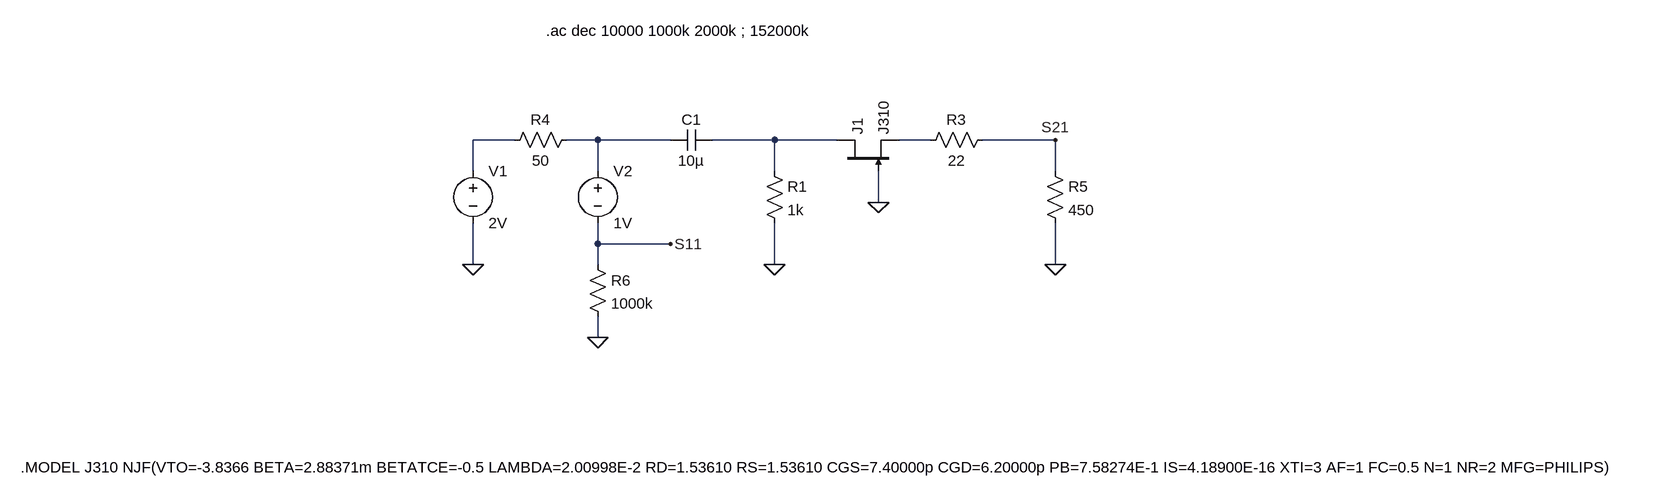
[diagram p0: schematic Draft3.asc]
Draft3.asc, the LTspice schematic file:
Version 4
SHEET 1 1640 696
WIRE -224 176 -288 176
WIRE -96 176 -144 176
WIRE 16 176 -96 176
WIRE 176 176 80 176
WIRE 272 176 176 176
WIRE 416 176 368 176
WIRE 608 176 496 176
WIRE -288 224 -288 176
WIRE -96 224 -96 176
WIRE 176 224 176 176
WIRE 608 224 608 176
WIRE 336 272 336 224
WIRE -96 336 -96 304
WIRE 16 336 -96 336
WIRE -288 368 -288 304
WIRE -96 368 -96 336
WIRE 176 368 176 304
WIRE 608 368 608 304
WIRE -96 480 -96 448
FLAG -288 368 0
FLAG -96 480 0
FLAG 176 368 0
FLAG 336 272 0
FLAG 608 368 0
FLAG 16 336 S11
FLAG 608 176 S21
SYMBOL cap 80 160 R90
WINDOW 0 0 32 VBottom 2
WINDOW 3 32 32 VTop 2
SYMATTR InstName C1
SYMATTR Value 10µ
SYMBOL res 160 208 R0
SYMATTR InstName R1
SYMATTR Value 1k
SYMBOL res 512 160 R90
WINDOW 0 0 56 VBottom 2
WINDOW 3 32 56 VTop 2
SYMATTR InstName R3
SYMATTR Value 22
SYMBOL njf 272 224 R270
SYMATTR InstName J1
SYMATTR Value J310
SYMBOL voltage -288 208 R0
WINDOW 123 0 0 Left 0
WINDOW 39 0 0 Left 0
SYMATTR InstName V1
SYMATTR Value 2V
SYMBOL voltage -96 208 R0
SYMATTR InstName V2
SYMATTR Value 1V
SYMBOL res -128 160 R90
WINDOW 0 0 56 VBottom 2
WINDOW 3 32 56 VTop 2
SYMATTR InstName R4
SYMATTR Value 50
SYMBOL res 592 208 R0
SYMATTR InstName R5
SYMATTR Value 450
SYMBOL res -112 352 R0
SYMATTR InstName R6
SYMATTR Value 1000k
TEXT -984 680 Left 2 !.MODEL J310 NJF(VTO=-3.8366 BETA=2.88371m BETATCE=-0.5 LAMBDA=2.00998E-2 RD=1.53610 RS=1.53610 CGS=7.40000p CGD=6.20000p PB=7.58274E-1 IS=4.18900E-16 XTI=3 AF=1 FC=0.5 N=1 NR=2 MFG=PHILIPS)
TEXT -176 8 Left 2 !.ac dec 10000 1000k 2000k ; 152000k

The netlist it stands for:
* Draft3.asc
C1 N003 N002 10µ
R1 N003 0 1k
R3 S21 N004 22
J1 N003 0 N004 J310
V1 N001 0 2V
V2 N002 S11 1V
R4 N002 N001 50
R5 S21 0 450
R6 S11 0 1000k
.model NJF NJF
.model PJF PJF
.lib standard.jft
.MODEL J310 NJF(VTO=-3.8366 BETA=2.88371m BETATCE=-0.5 LAMBDA=2.00998E-2 RD=1.53610 RS=1.53610 CGS=7.40000p CGD=6.20000p PB=7.58274E-1 IS=4.18900E-16 XTI=3 AF=1 FC=0.5 N=1 NR=2 MFG=PHILIPS)
.ac dec 10000 1000k 2000k ; 152000k
.backanno
.end